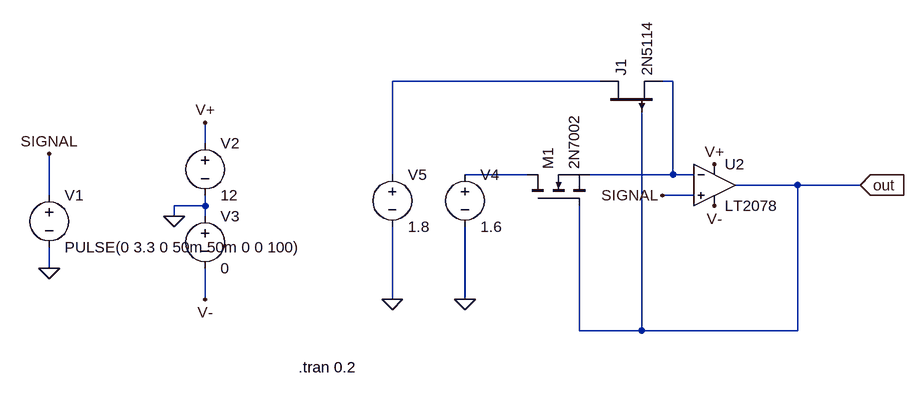
[diagram p0: schematic hysteresis_alt.asc]
hysteresis_alt.asc, the LTspice schematic file:
Version 4
SHEET 1 880 916
WIRE -32 32 -352 32
WIRE 80 32 64 32
WIRE -640 128 -640 96
WIRE -352 176 -352 32
WIRE -144 176 -240 176
WIRE 80 176 80 32
WIRE 80 176 -48 176
WIRE 112 176 80 176
WIRE 272 192 176 192
WIRE 368 192 272 192
WIRE -880 208 -880 144
WIRE 112 208 64 208
WIRE -640 224 -640 208
WIRE -640 224 -688 224
WIRE -688 240 -688 224
WIRE -640 240 -640 224
WIRE -880 320 -880 288
WIRE -640 368 -640 320
WIRE -352 368 -352 256
WIRE -240 368 -240 256
WIRE -64 416 -64 224
WIRE 32 416 32 80
WIRE 32 416 -64 416
WIRE 272 416 272 192
WIRE 272 416 32 416
FLAG -688 240 0
FLAG -640 96 V+
FLAG 144 160 V+
FLAG -640 368 V-
FLAG 144 224 V-
FLAG -880 144 SIGNAL
FLAG -880 320 0
FLAG 368 192 out
IOPIN 368 192 In
FLAG 64 208 SIGNAL
FLAG -240 368 0
FLAG -352 368 0
SYMBOL voltage -880 192 R0
WINDOW 123 0 0 Left 2
WINDOW 39 0 0 Left 2
SYMATTR InstName V1
SYMATTR Value PULSE(0 3.3 0 50m 50m 0 0 100)
SYMBOL voltage -640 112 R0
WINDOW 123 0 0 Left 2
WINDOW 39 0 0 Left 2
SYMATTR InstName V2
SYMATTR Value 12
SYMBOL voltage -640 224 R0
WINDOW 123 0 0 Left 2
WINDOW 39 0 0 Left 2
SYMATTR InstName V3
SYMATTR Value 0
SYMBOL Opamps\\LT2078 144 128 R0
SYMATTR InstName U2
SYMBOL voltage -240 160 R0
WINDOW 123 0 0 Left 2
WINDOW 39 0 0 Left 2
SYMATTR InstName V4
SYMATTR Value 1.6
SYMBOL voltage -352 160 R0
WINDOW 123 0 0 Left 2
WINDOW 39 0 0 Left 2
SYMATTR InstName V5
SYMATTR Value 1.8
SYMBOL nmos -144 224 R270
SYMATTR InstName M1
SYMATTR Value 2N7002
SYMBOL pjf -32 80 R270
SYMATTR InstName J1
SYMATTR Value 2N5114
TEXT -496 472 Left 2 !.tran 0.2

The netlist it stands for:
* hysteresis_alt.asc
V1 SIGNAL 0 PULSE(0 3.3 0 50m 50m 0 0 100)
V2 V+ 0 12
V3 0 V- 0
XU2 SIGNAL N002 V+ V- out LT2078  ; pins In+ In- V+ V- OUT
V4 N003 0 1.6
V5 N001 0 1.8
M1 N003 out N002 N002 2N7002
J1 N001 out N002 2N5114
.model NJF NJF
.model PJF PJF
.lib standard.jft
.model NMOS NMOS
.model PMOS PMOS
.lib standard.mos
.tran 0.2
.backanno
.end